# Altium schematic sheet RK3568-SOM-PWR.SchDoc: Ethernet PHY with RJ45 connector
size A2; Date: Not used; ApprovedBy: Not used; CheckedBy: Not used; Author: Not used; CompanyName: STMicroelectronics; DrawnBy: Not used; Engineer: Not used; Organization: Not used; Address1: Not used; Address2: Not used; Address3: Not used; Address4: Not used; DocumentNumber: 6; Revision: Not used; SheetNumber: 6; SheetTotal: 9; Time: Not used; ImagePath: Not used; Application_BuildNumber: Not used
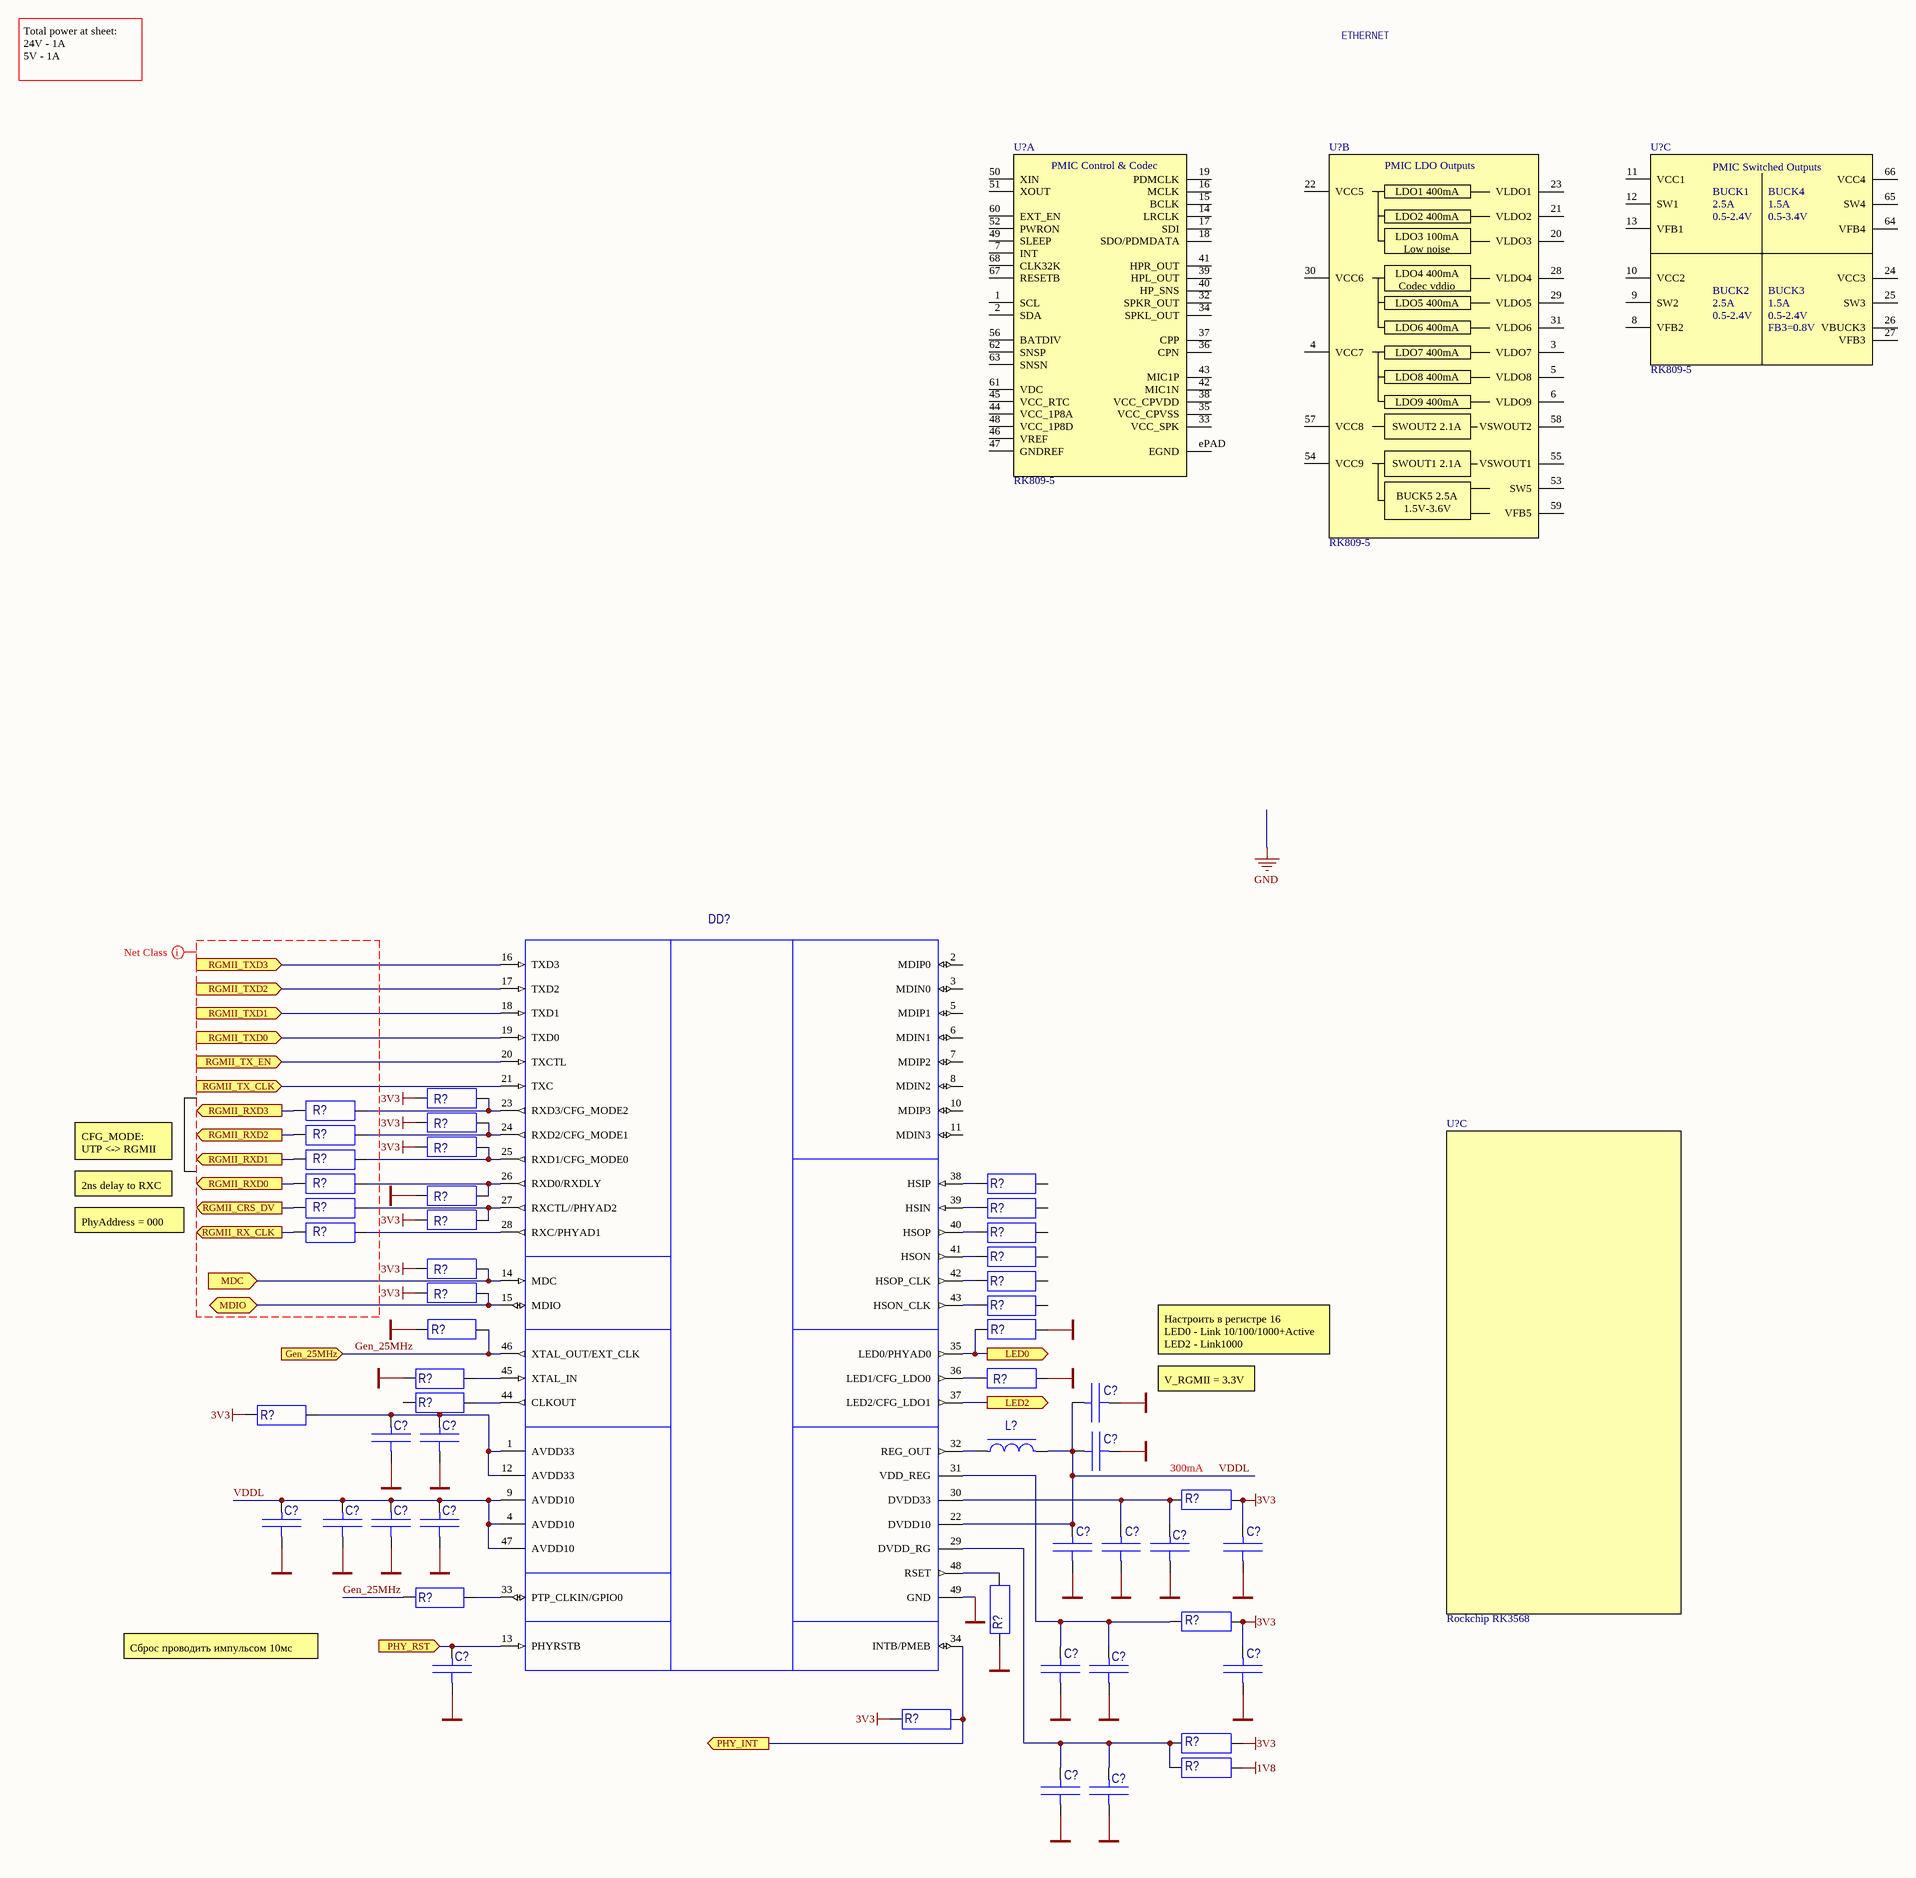
[diagram p0: RK3568-SOM-PWR.SchDoc]

## Parts
(Parts that share a designator on the sheet are numbered #1, #2 ... from top to bottom, then left to right.)
C?#1  C0805-16В-4,7мкФ-10%-X7R (CCTC, TCC0805X7R475K160FT)  [CC0805-KL]  (value not drawn)
C?#2  C0402-16В-0,1мкФ-10%-X7R (CCTC, TCC0402X7R104K160AT)  [C0402]  (value not drawn)
C?#3  C0402-16В-0,1мкФ-10%-X7R (CCTC, TCC0402X7R104K160AT)  [C0402]  (value not drawn)
C?#4  C0402-16В-0,1мкФ-10%-X7R (CCTC, TCC0402X7R104K160AT)  [C0402]  (value not drawn)
C?#5  C0603-25В-1,0мкФ-10%-X7R (CCTC, TCC0603X7R105K250CT)  [CC0603-KL]  (value not drawn)
C?#6  C0402-16В-0,1мкФ-10%-X7R (CCTC, TCC0402X7R104K160AT)  [C0402]  (value not drawn)
C?#7  C0402-16В-0,1мкФ-10%-X7R (CCTC, TCC0402X7R104K160AT)  [C0402]  (value not drawn)
C?#8  C0402-16В-0,1мкФ-10%-X7R (CCTC, TCC0402X7R104K160AT)  [C0402]  (value not drawn)
C?#9  C0402-16В-0,1мкФ-10%-X7R (CCTC, TCC0402X7R104K160AT)  [C0402]  (value not drawn)
C?#10  C0402-16В-0,1мкФ-10%-X7R (CCTC, TCC0402X7R104K160AT)  [C0402]  (value not drawn)
C?#11  C0603-25В-1,0мкФ-10%-X7R (CCTC, TCC0603X7R105K250CT)  [CC0603-KL]  (value not drawn)
C?#12  C0402-16В-0,1мкФ-10%-X7R (CCTC, TCC0402X7R104K160AT)  [C0402]  (value not drawn)
C?#13  C0402-16В-0,1мкФ-10%-X7R (CCTC, TCC0402X7R104K160AT)  [C0402]  (value not drawn)
C?#14  C0402-16В-0,1мкФ-10%-X7R (CCTC, TCC0402X7R104K160AT)  [C0402]  (value not drawn)
C?#15  C0603-25В-1,0мкФ-10%-X7R (CCTC, TCC0603X7R105K250CT)  [CC0603-KL]  (value not drawn)
C?#16  C0402-16В-0,1мкФ-10%-X7R (CCTC, TCC0402X7R104K160AT)  [C0402]  (value not drawn)
C?#17  C0402-16В-0,1мкФ-10%-X7R (CCTC, TCC0402X7R104K160AT)  [C0402]  (value not drawn)
C?#18  C0603-25В-1,0мкФ-10%-X7R (CCTC, TCC0603X7R105K250CT)  [CC0603-KL]  (value not drawn)
DD?  RTL8211FSI-VS-CG (REALTEK, QFN-48)  [QFN40P600X600X100-with_vias]  (value not drawn)
L?  L1210-2,2мкГн-20%-3,6А-75мОм (3Lcoils, LHP322512-2R2M)  [IND3225X135]  (value not drawn)
R?#1  (no value)  [R0402]
R?#2  RC02-22 Ом-1%  [R0402]  (value not drawn)
R?#3  (no value)  [R0402]
R?#4  RC02-22 Ом-1%  [R0402]  (value not drawn)
R?#5  (no value)  [R0402]
R?#6  RC02-22 Ом-1%  [R0402]  (value not drawn)
R?#7  RC02-22 Ом-1%  [R0402]  (value not drawn)
R?#8  RC02-0,0 Ом 5%  [R0402]  (value not drawn)
R?#9  (no value)  [R0402]
R?#10  RC02-22 Ом-1%  [R0402]  (value not drawn)
R?#11  RC02-0,0 Ом 5%  [R0402]  (value not drawn)
R?#12  (no value)  [R0402]
R?#13  RC02-22 Ом-1%  [R0402]  (value not drawn)
R?#14  RC02-0,0 Ом 5%  [R0402]  (value not drawn)
R?#15  RC02-0,0 Ом 5%  [R0402]  (value not drawn)
R?#16  RC02-2,0кОм 5%  [R0402]  (value not drawn)
R?#17  RC02-0,0 Ом 5%  [R0402]  (value not drawn)
R?#18  RC02-2,0кОм 5%  [R0402]  (value not drawn)
R?#19  RC02-0,0 Ом 5%  [R0402]  (value not drawn)
R?#20  RC02-4,7кОм 5%  [R0402]  (value not drawn)
R?#21  RC02-4,7кОм 5%  [R0402]  (value not drawn)
R?#22  RC02-0,0 Ом 5%  [R0402]  (value not drawn)
R?#23  RC02-2,0кОм 5%  [R0402]  (value not drawn)
R?#24  (no value)  [R0402]
R?#25  RC02-0,0 Ом 5%  [R0402]  (value not drawn)
R?#26  RC02-0,0 Ом 5%  [R0402]  (value not drawn)
R?#27  (no value)  [R0402]
R?#28  RC02-0,0 Ом 5%  [R0402]  (value not drawn)
R?#29  RC03-2,49кОм 1% (Walsin, WR06X2491FTL)  [RC0603-KL]  (value not drawn)
R?#30  RC02-4,7кОм 5%  [R0402]  (value not drawn)
R?#31  RC02-0,0 Ом 5%  [R0402]  (value not drawn)
R?#32  (no value)  [R0402]
U?#1  *  [QFN40P600X600X100-with_vias]  (value not drawn)  (part C of 3)
U?#2  *  [QFN40P600X600X100-with_vias]  (value not drawn)  (part A of 3)
U?#3  *  [QFN40P600X600X100-with_vias]  (value not drawn)  (part B of 3)
U?#4  PartNumber: Rockchip RK3568  [ESQ-120-14-G-D]  (hidden comment: *)  (part C of 6)

## Ports
Gen_25MHz (in), LED0 (out), LED2 (out), MDC (in), MDIO (bidir), PHY_INT (out), PHY_RST (in), RGMII_CRS_DV (out), RGMII_RX_CLK (out), RGMII_RXD0 (out), RGMII_RXD1 (out), RGMII_RXD2 (out), RGMII_RXD3 (out), RGMII_TX_CLK (in), RGMII_TX_EN (in), RGMII_TXD0 (in), RGMII_TXD1 (in), RGMII_TXD2 (in), RGMII_TXD3 (in)

## Nets
1V8: R?#32.2
3V3: C?#12.1 C?#16.1 R?#1.1 R?#3.1 R?#5.1 R?#12.1 R?#16.1 R?#18.1 R?#25.2 R?#26.2 R?#28.2 R?#30.2 R?#31.2
GND: C?#1.2 C?#2.2 C?#3.2 C?#4.2 C?#5.2 C?#6.2 C?#7.2 C?#8.2 C?#9.2 C?#10.2 C?#11.2 C?#12.2 C?#13.2 C?#14.2 C?#15.2 C?#16.2 C?#17.2 C?#18.2 DD?.49(GND) R?#9.1 R?#20.1 R?#21.2 R?#22.2 R?#23.2 R?#29.1
Gen_25MHz: DD?.46(XTAL_OUT/EXT_CLK) R?#20.2 R?#27.2 ; port Gen_25MHz
LED0: DD?.35(LED0/PHYAD0) R?#21.1 ; port LED0
LED2: DD?.37(LED2/CFG_LDO1) ; port LED2
MDC: DD?.14(MDC) R?#16.2 ; port MDC
MDIO: DD?.15(MDIO) R?#18.2 ; port MDIO
PHY_INT: DD?.34(INTB/PMEB) R?#30.1 ; port PHY_INT
PHY_RST: C?#13.1 DD?.13(PHYRSTB) ; port PHY_RST
RGMII_CRS_DV: R?#10.2 ; port RGMII_CRS_DV
RGMII_RX_CLK: R?#13.2 ; port RGMII_RX_CLK
RGMII_RXD0: R?#7.2 ; port RGMII_RXD0
RGMII_RXD1: R?#6.2 ; port RGMII_RXD1
RGMII_RXD2: R?#4.2 ; port RGMII_RXD2
RGMII_RXD3: R?#2.2 ; port RGMII_RXD3
RGMII_TX_CLK: DD?.21(TXC) ; port RGMII_TX_CLK
RGMII_TX_EN: DD?.20(TXCTL) ; port RGMII_TX_EN
RGMII_TXD0: DD?.19(TXD0) ; port RGMII_TXD0
RGMII_TXD1: DD?.18(TXD1) ; port RGMII_TXD1
RGMII_TXD2: DD?.17(TXD2) ; port RGMII_TXD2
RGMII_TXD3: DD?.16(TXD3) ; port RGMII_TXD3
VDDL: C?#1.1 C?#4.1 C?#5.1 C?#6.1 C?#7.1 C?#8.1 C?#9.1 DD?.4(AVDD10) DD?.9(AVDD10) DD?.22(DVDD10) DD?.47(AVDD10) L?.2
NetC?#2_1: C?#2.1 C?#3.1 DD?.1(AVDD33) DD?.12(AVDD33) R?#25.1
NetC?#10_1: C?#10.1 C?#11.1 DD?.30(DVDD33) R?#26.1
NetC?#14_1: C?#14.1 C?#15.1 DD?.31(VDD_REG) R?#28.1
NetC?#17_1: C?#17.1 C?#18.1 DD?.29(DVDD_RG) R?#31.1 R?#32.1
NetDD?_23: DD?.23(RXD3/CFG_MODE2) R?#1.2 R?#2.1
NetDD?_24: DD?.24(RXD2/CFG_MODE1) R?#3.2 R?#4.1
NetDD?_25: DD?.25(RXD1/CFG_MODE0) R?#5.2 R?#6.1
NetDD?_26: DD?.26(RXD0/RXDLY) R?#7.1 R?#9.2
NetDD?_27: DD?.27(RXCTL//PHYAD2) R?#10.1 R?#12.2
NetDD?_28: DD?.28(RXC/PHYAD1) R?#13.1
NetDD?_32: DD?.32(REG_OUT) L?.1
NetDD?_33: DD?.33(PTP_CLKIN/GPIO0) R?#27.1
NetDD?_36: DD?.36(LED1/CFG_LDO0) R?#23.1
NetDD?_38: DD?.38(HSIP) R?#8.2
NetDD?_39: DD?.39(HSIN) R?#11.2
NetDD?_40: DD?.40(HSOP) R?#14.2
NetDD?_41: DD?.41(HSON) R?#15.2
NetDD?_42: DD?.42(HSOP_CLK) R?#17.2
NetDD?_43: DD?.43(HSON_CLK) R?#19.2
NetDD?_44: DD?.44(CLKOUT) R?#24.1
NetDD?_45: DD?.45(XTAL_IN) R?#22.1
NetDD?_48: DD?.48(RSET) R?#29.2

Not connected (* = marked no-connect by the designer): DD? 2(MDIP0) 3(MDIN0) 5(MDIP1) 6(MDIN1) 7(MDIP2) 8(MDIN2) 10(MDIP3) 11(MDIN3); R?#8 1; R?#11 1; R?#14 1; R?#15 1; R?#17 1; R?#19 1; R?#24 2; U?#1 8(VFB2) 9(SW2) 10(VCC2) 11(VCC1) 12(SW1) 13(VFB1) 24(VCC3) 25(SW3) 26(VBUCK3) 27(VFB3) 64(VFB4) 65(SW4) 66(VCC4); U?#2 1(SCL) 2(SDA) 7(INT) 14(LRCLK) 15(BCLK) 16(MCLK) 17(SDI) 18(SDO/PDMDATA) 19(PDMCLK) 32(SPKR_OUT) 33(VCC_SPK) 34(SPKL_OUT) 35(VCC_CPVSS) 36(CPN) 37(CPP) 38(VCC_CPVDD) 39(HPL_OUT) 40(HP_SNS) 41(HPR_OUT) 42(MIC1N) 43(MIC1P) 44(VCC_1P8A) 45(VCC_RTC) 46(VREF) 47(GNDREF) 48(VCC_1P8D) 49(SLEEP) 50(XIN) 51(XOUT) 52(PWRON) 56(BATDIV) 60(EXT_EN) 61(VDC) 62(SNSP) 63(SNSN) 67(RESETB) 68(CLK32K) ePAD(EGND); U?#3 3(VLDO7) 4(VCC7) 5(VLDO8) 6(VLDO9) 20(VLDO3) 21(VLDO2) 22(VCC5) 23(VLDO1) 28(VLDO4) 29(VLDO5) 30(VCC6) 31(VLDO6) 53(SW5) 54(VCC9) 55(VSWOUT1) 57(VCC8) 58(VSWOUT2) 59(VFB5)

## Layout directives
net class SE50: (no net found under the mark)

## Notes on the sheet
- Total power at sheet:
  24V - 1A
  5V - 1A
- ETHERNET
- CFG_MODE:
  UTP <-> RGMII
- 2ns delay to RXC
- PhyAddress = 000
- Настроить в регистре 16
  LED0 - Link 10/100/1000+Active
  LED2 - Link1000
- V_RGMII = 3.3V
- (near R?#26) 300mA
- Сброс проводить импульсом 10мс
- Title
- Size:
- Date:
- File:
- A2
- Number:
- Time:
- Revision:
- Sheet
- of
- (in symbol RK809-5, part A) PMIC Control & Codec
- (in symbol RK809-5, part B) PMIC LDO Outputs; LDO1 400mA; LDO2 400mA; LDO3 100mA / Low noise; LDO4 400mA / Codec vddio; LDO5 400mA; LDO6 400mA; LDO7 400mA; LDO8 400mA; LDO9 400mA; SWOUT2 2.1A; SWOUT1 2.1A; BUCK5 2.5A / 1.5V-3.6V
- (in symbol RK809-5, part C) PMIC Switched Outputs; BUCK1; BUCK4; 2.5A; 1.5A; 0.5-2.4V; 0.5-3.4V; BUCK2; BUCK3; FB3=0.8V

## Library data of the parts
C?#1 = C0805: Chip Capacitor (MLCC), 0805, Umax=200V, SIZE=2.0x1.3x1.3mm, SMT; Value: C0805-16В-4,7мкФ-10%-X7R (CCTC, TCC0805X7R475K160FT)
C?#2-C?#4 C?#6-C?#10 C?#12-C?#14 C?#16 C?#17 = C0402: Value: C0402-16В-0,1мкФ-10%-X7R (CCTC, TCC0402X7R104K160AT)
C?#5 C?#11 C?#15 C?#18 = C0603: Chip Capacitor (MLCC), 0603, Umax=100V, SIZE=1.6x0.8x0.9mm, SMT; Value: C0603-25В-1,0мкФ-10%-X7R (CCTC, TCC0603X7R105K250CT); Currency: *; Distributor: *; PartNumber: *; HelpURL: *; Manufacturer: *; Volume1: *; Price1: *
DD? = RTL8211: Integrated 10/100/1000M Ethernet precision  transceiver. Provides physical layer functions.; Value: RTL8211FSI-VS-CG (REALTEK, QFN-48)
L? = L1210: Fixed Inductor L1210, SIZE=3.2x2.5x1.2mm; Value: L1210-2,2мкГн-20%-3,6А-75мОм (3Lcoils, LHP322512-2R2M)
R?#1-R?#28 R?#30-R?#32 = R0402
  R?#2 R?#4 R?#6 R?#7 R?#10 R?#13: Value: RC02-22 Ом-1%
  R?#8 R?#11 R?#14 R?#15 R?#17 R?#19 R?#22 R?#25 R?#26 R?#28 R?#31: Value: RC02-0,0 Ом 5%
  R?#16 R?#18 R?#23: Value: RC02-2,0кОм 5%
  R?#20 R?#21 R?#30: Value: RC02-4,7кОм 5%
R?#29 = RC03: Chip Resistor, 0603, Pmax=0.100W, Umax=50V, SIZE=1.6x0.9x0.5mm, SMT; Value: RC03-2,49кОм 1% (Walsin, WR06X2491FTL); Currency: *; Distributor: *; PartNumber: *; HelpURL: *; Manufacturer: *; Volume1: *; Price1: *
U?#1-U?#3 = RK809-5: PMIC for Realtek microprocessors. QFN68 (7x7); Value: *; ComponentLink1Description: DataSheet; ComponentLink1URL: https://doc.inmys.ru/open?hash=b56d315854d8f1360d0c6d279788734c; PartNumber: RK809-5
U?#4 = RK3568: Rockchip RK3568 Quad-core Cortex-A55, 2.0GHz; Manufacturer: TE Connectivity; Manufacturer Part Number: 1717254-4; Connector Type: Receptacle; Number of Positions: 200; Number of Positions Loaded: All; Pitch: 0.100" (2.54mm); .Creator: MM; Supplier 1: Digi-Key; RoHS: RoHS Compliant; Category: Connectors, Interconnects; Stock 1: 51; Pricing 1: 1=7.42, 10=6.864, 50=6.1586, 100=5.7505, 250=5.00852, 500=4.823, 1000=4.6375, 2500=4.452 (USD); Packaging: Tape & Reel; Contact Type: Female Socket; Number of Rows: 2; Row Spacing: 0.100" (2.54mm); Mounting Type: Through Hole; Termination: Solder; Fastening Type: -; Features: -; Contact Finish: Gold; Contact Finish Thickness: 20µin (0.51µm); Color: Black; ComponentLink1URL: https://wiki.inmys.ru/doku.php?id=wiki:cmp:proc:rockchip-rk3568:start; ComponentLink1Description: DataSheet; Supplier Part Number 1: SAM8767-ND; .Checked PCB: MM; .Checked SCH: MM; Value: *